# Altium project 7SegmentDriver.PrjPcb
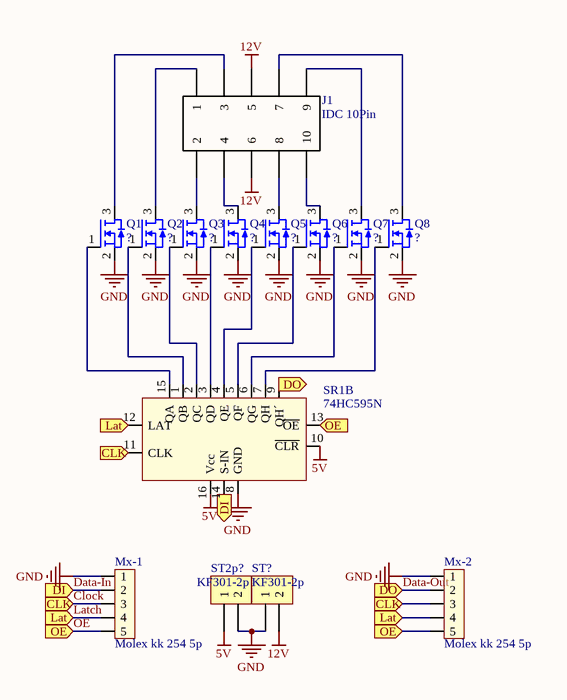
[diagram p0: 7SegmentDriver.SchDoc]
1 sheet, 14 parts. Net scope: flat (ports and power ports of the same name join across sheets).
Board file: 7SegmentDriver.PcbDoc

## Sheet 7SegmentDriver.SchDoc
size A4

### Parts
J1  IDC 10Pin  [IDC 10 Pin]
Mx-1  Molex kk 254 5p  [Molex kk 254 5p]
Mx-2  Molex kk 254 5p  [Molex kk 254 5p]
Q1  ?  [SOT23 Handsoldering]
Q2  ?  [SOT23 Handsoldering]
Q3  ?  [SOT23 Handsoldering]
Q4  ?  [SOT23 Handsoldering]
Q5  ?  [SOT23 Handsoldering]
Q6  ?  [SOT23 Handsoldering]
Q7  ?  [SOT23 Handsoldering]
Q8  ?  [SOT23 Handsoldering]
SR1  74HC595N  [74HC595N]  (part B of 2)
ST2p?  KF301-2p  [KF301-2p_0.2"]
ST?  KF301-2p  [KF301-2p_0.2"]

### Ports
CLK, DI, DO, Lat, OE

### Nets
5V: SR1.10(~{CLR}) SR1.16(Vcc) ST2p?.1
12V: J1.5 J1.6 ST?.2
GND: Mx-1.1 Mx-2.1 Q1.2 Q2.2 Q3.2 Q4.2 Q5.2 Q6.2 Q7.2 Q8.2 SR1.8(GND) ST2p?.2 ST?.1
Clock: Mx-1.3 Mx-2.3 SR1.11(CLK) ; port CLK
Data-In: Mx-1.2 SR1.14(S-IN) ; port DI
Data-Out: Mx-2.2 SR1.9(QH´) ; port DO
Latch: Mx-1.4 Mx-2.4 SR1.12(LAT) ; port Lat
OE: Mx-1.5 Mx-2.5 SR1.13(~{OE}) ; port OE
NetJ1_1: J1.1 Q2.3
NetJ1_2: J1.2 Q3.3
NetJ1_3: J1.3 Q1.3
NetJ1_4: J1.4 Q4.3
NetJ1_7: J1.7 Q8.3
NetJ1_8: J1.8 Q5.3
NetJ1_9: J1.9 Q7.3
NetJ1_10: J1.10 Q6.3
NetQ1_1: Q1.1 SR1.15(QA)
NetQ2_1: Q2.1 SR1.1(QB)
NetQ3_1: Q3.1 SR1.2(QC)
NetQ4_1: Q4.1 SR1.3(QD)
NetQ5_1: Q5.1 SR1.4(QE)
NetQ6_1: Q6.1 SR1.5(QF)
NetQ7_1: Q7.1 SR1.6(QG)
NetQ8_1: Q8.1 SR1.7(QH)

### Library data of the parts
Q1-Q8 = AO3400: AO3400 n-mosfet 30v 5.8A SOT23
ST2p? ST? = KF301-2p_0.2": Screw terminal KF301-2p 0.2" pitch 5.08mm